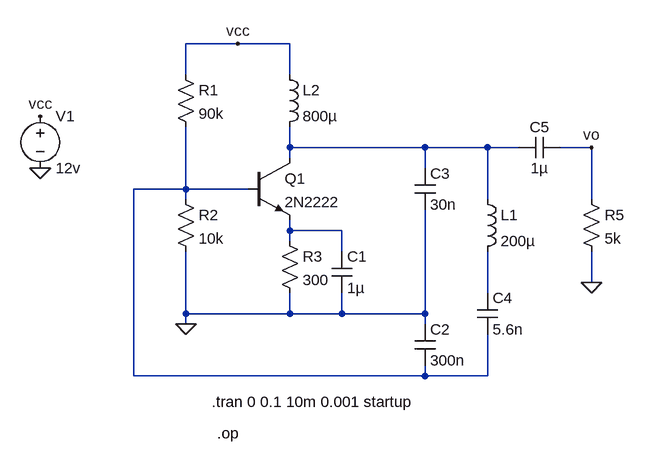
[diagram p0: schematic OSCILADOR.asc]
OSCILADOR.asc, the LTspice schematic file:
Version 4
SHEET 1 880 680
WIRE 224 -32 144 -32
WIRE 304 -32 224 -32
WIRE 144 16 144 -32
WIRE 304 16 304 -32
WIRE 304 128 304 96
WIRE 512 128 304 128
WIRE 608 128 512 128
WIRE 656 128 608 128
WIRE 768 128 720 128
WIRE 304 144 304 128
WIRE 512 160 512 128
WIRE 144 192 144 96
WIRE 144 192 64 192
WIRE 240 192 144 192
WIRE 144 208 144 192
WIRE 608 208 608 128
WIRE 768 208 768 128
WIRE 304 256 304 240
WIRE 384 256 304 256
WIRE 304 272 304 256
WIRE 384 288 384 256
WIRE 768 336 768 288
WIRE 608 352 608 288
WIRE 144 384 144 288
WIRE 304 384 304 352
WIRE 304 384 144 384
WIRE 384 384 384 352
WIRE 384 384 304 384
WIRE 512 384 512 224
WIRE 512 384 384 384
WIRE 144 400 144 384
WIRE 512 400 512 384
WIRE 64 480 64 192
WIRE 512 480 512 464
WIRE 512 480 64 480
WIRE 608 480 608 416
WIRE 608 480 512 480
FLAG 144 400 0
FLAG 768 336 0
FLAG -80 80 vcc
FLAG -80 160 0
FLAG 224 -32 vcc
FLAG 768 128 vo
DATAFLAG 336 128 ""
DATAFLAG 304 256 ""
DATAFLAG 144 192 ""
SYMBOL res 128 0 R0
SYMATTR InstName R1
SYMATTR Value 90k
SYMBOL res 128 192 R0
SYMATTR InstName R2
SYMATTR Value 10k
SYMBOL npn 240 144 R0
SYMATTR InstName Q1
SYMATTR Value 2N2222
SYMBOL cap 368 288 R0
SYMATTR InstName C1
SYMATTR Value 1µ
SYMBOL res 288 256 R0
SYMATTR InstName R3
SYMATTR Value 300
SYMBOL cap 496 400 R0
SYMATTR InstName C2
SYMATTR Value 300n
SYMBOL cap 496 160 R0
SYMATTR InstName C3
SYMATTR Value 30n
SYMBOL cap 592 352 R0
SYMATTR InstName C4
SYMATTR Value 5.6n
SYMBOL ind 592 192 R0
SYMATTR InstName L1
SYMATTR Value 200µ
SYMATTR SpiceLine Rser=1
SYMBOL cap 656 112 M90
WINDOW 0 0 32 VBottom 2
WINDOW 3 32 32 VTop 2
SYMATTR InstName C5
SYMATTR Value 1µ
SYMBOL res 752 192 R0
SYMATTR InstName R5
SYMATTR Value 5k
SYMBOL voltage -80 64 R0
WINDOW 123 0 0 Left 0
WINDOW 39 0 0 Left 0
SYMATTR InstName V1
SYMATTR Value 12v
SYMBOL ind 288 0 R0
SYMATTR InstName L2
SYMATTR Value 800µ
TEXT 184 520 Left 2 !.tran 0 0.1 10m 0.001 startup
TEXT 192 568 Left 2 !.op

The netlist it stands for:
* OSCILADOR.asc
R1 vcc N002 90k
R2 N002 0 10k
Q1 N001 N002 N003 0 2N2222
C1 N003 0 1µ
R3 N003 0 300
C2 0 N002 300n
C3 N001 0 30n
C4 N004 N002 5.6n
L1 N001 N004 200µ Rser=1
C5 N001 vo 1µ
R5 vo 0 5k
V1 vcc 0 12v
L2 vcc N001 800µ
.model NPN NPN
.model PNP PNP
.lib standard.bjt
.tran 0 0.1 10m 0.001 startup
.op
.backanno
.end